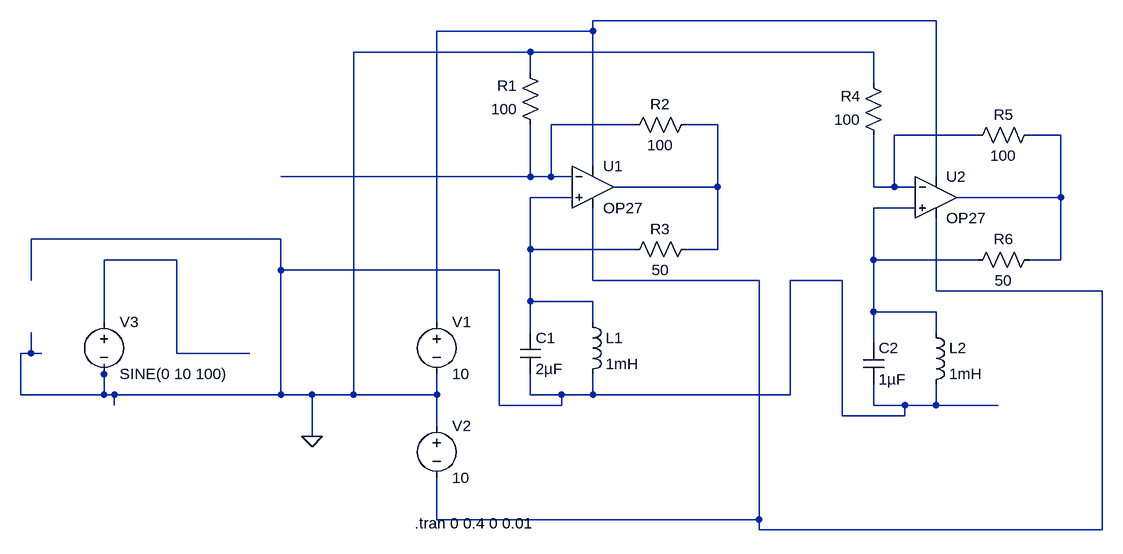
[diagram p0: schematic osc_neg_res.asc]
osc_neg_res.asc, the LTspice schematic file:
Version 4
SHEET 1 884 680
WIRE 624 -304 96 -304
WIRE 96 -288 96 -304
WIRE 96 -288 -144 -288
WIRE 0 -256 -272 -256
WIRE 528 -256 0 -256
WIRE 0 -224 0 -256
WIRE 528 -208 528 -256
WIRE 160 -144 32 -144
WIRE 288 -144 240 -144
WIRE 688 -128 560 -128
WIRE 816 -128 768 -128
WIRE 96 -80 96 -288
WIRE 0 -64 0 -144
WIRE 0 -64 -384 -64
WIRE 32 -64 32 -144
WIRE 32 -64 0 -64
WIRE 64 -64 32 -64
WIRE 624 -64 624 -304
WIRE 288 -48 288 -144
WIRE 288 -48 128 -48
WIRE 528 -48 528 -128
WIRE 560 -48 560 -128
WIRE 560 -48 528 -48
WIRE 592 -48 560 -48
WIRE 64 -32 0 -32
WIRE 816 -32 816 -128
WIRE 816 -32 656 -32
WIRE 592 -16 528 -16
WIRE -384 32 -768 32
WIRE 0 48 0 -32
WIRE 160 48 0 48
WIRE 288 48 288 -48
WIRE 288 48 240 48
WIRE -544 64 -656 64
WIRE 528 64 528 -16
WIRE 688 64 528 64
WIRE 816 64 816 -32
WIRE 816 64 768 64
WIRE -384 80 -384 32
WIRE -48 80 -384 80
WIRE -768 96 -768 32
WIRE 96 96 96 -16
WIRE 352 96 96 96
WIRE 480 96 400 96
WIRE 624 112 624 0
WIRE 880 112 624 112
WIRE 0 128 0 48
WIRE 96 128 0 128
WIRE 528 144 528 64
WIRE 624 144 528 144
WIRE -656 160 -656 64
WIRE -144 160 -144 -288
WIRE 96 160 96 128
WIRE 0 176 0 128
WIRE 624 176 624 144
WIRE 528 192 528 144
WIRE -768 208 -768 176
WIRE -768 208 -784 208
WIRE -752 208 -768 208
WIRE -544 208 -544 64
WIRE -432 208 -544 208
WIRE -656 240 -656 224
WIRE -784 272 -784 208
WIRE -656 272 -656 240
WIRE -656 272 -784 272
WIRE -640 272 -656 272
WIRE -384 272 -384 80
WIRE -384 272 -640 272
WIRE -336 272 -384 272
WIRE -272 272 -272 -256
WIRE -272 272 -336 272
WIRE -144 272 -144 240
WIRE -144 272 -272 272
WIRE 0 272 0 240
WIRE 48 272 0 272
WIRE 96 272 96 240
WIRE 96 272 48 272
WIRE 400 272 400 96
WIRE 400 272 96 272
WIRE -640 288 -640 272
WIRE -48 288 -48 80
WIRE 48 288 48 272
WIRE 48 288 -48 288
WIRE 528 288 528 256
WIRE 576 288 528 288
WIRE 624 288 624 256
WIRE 624 288 576 288
WIRE 720 288 624 288
WIRE 480 304 480 96
WIRE 576 304 576 288
WIRE 576 304 480 304
WIRE -144 320 -144 272
WIRE -336 336 -336 272
WIRE -320 336 -336 336
WIRE -144 464 -144 400
WIRE 352 464 352 96
WIRE 352 464 -144 464
WIRE 352 480 352 464
WIRE 880 480 880 112
WIRE 880 480 352 480
FLAG -336 336 0
SYMBOL ind 80 144 R0
SYMATTR InstName L1
SYMATTR Value 1mH
SYMBOL cap -16 176 R0
SYMATTR InstName C1
SYMATTR Value 2µF
SYMBOL voltage -144 144 R0
WINDOW 123 0 0 Left 2
WINDOW 39 0 0 Left 2
SYMATTR InstName V1
SYMATTR Value 10
SYMBOL voltage -144 304 R0
WINDOW 123 0 0 Left 2
WINDOW 39 0 0 Left 2
SYMATTR InstName V2
SYMATTR Value 10
SYMBOL res 16 -128 R180
WINDOW 0 36 76 Left 2
WINDOW 3 36 40 Left 2
SYMATTR InstName R1
SYMATTR Value 100
SYMBOL res 256 -160 R90
WINDOW 0 0 56 VBottom 2
WINDOW 3 32 56 VTop 2
SYMATTR InstName R2
SYMATTR Value 100
SYMBOL res 256 32 R90
WINDOW 0 0 56 VBottom 2
WINDOW 3 32 56 VTop 2
SYMATTR InstName R3
SYMATTR Value 50
SYMBOL Opamps\\OP27 96 -112 R0
SYMATTR InstName U1
SYMBOL voltage -656 144 R0
WINDOW 123 0 0 Left 2
WINDOW 39 0 0 Left 2
SYMATTR InstName V3
SYMATTR Value SINE(0 10 100)
SYMBOL ind 608 160 R0
SYMATTR InstName L2
SYMATTR Value 1mH
SYMBOL cap 512 192 R0
SYMATTR InstName C2
SYMATTR Value 1µF
SYMBOL res 544 -112 R180
WINDOW 0 36 76 Left 2
WINDOW 3 36 40 Left 2
SYMATTR InstName R4
SYMATTR Value 100
SYMBOL res 784 -144 R90
WINDOW 0 0 56 VBottom 2
WINDOW 3 32 56 VTop 2
SYMATTR InstName R5
SYMATTR Value 100
SYMBOL res 784 48 R90
WINDOW 0 0 56 VBottom 2
WINDOW 3 32 56 VTop 2
SYMATTR InstName R6
SYMATTR Value 50
SYMBOL Opamps\\OP27 624 -96 R0
SYMATTR InstName U2
TEXT -178 470 Left 2 !.tran 0 0.4 0 0.01

The netlist it stands for:
* osc_neg_res.asc
L1 N006 0 1mH
C1 N006 0 2µF
V1 N001 0 10
V2 0 N009 10
R1 N002 0 100
R2 N003 N002 100
R3 N003 N006 50
XU1 N006 N002 N001 N009 N003 OP27  ; pins In+ In- V+ V- OUT
V3 N008 0 SINE(0 10 100)
L2 N007 0 1mH
C2 N007 0 1µF
R4 N004 0 100
R5 N005 N004 100
R6 N005 N007 50
XU2 N007 N004 N001 N009 N005 OP27  ; pins In+ In- V+ V- OUT
.tran 0 0.4 0 0.01
.lib ADI.lib
.backanno
.end